# EAGLE schematic Regulators (EAGLE 8.6.0)
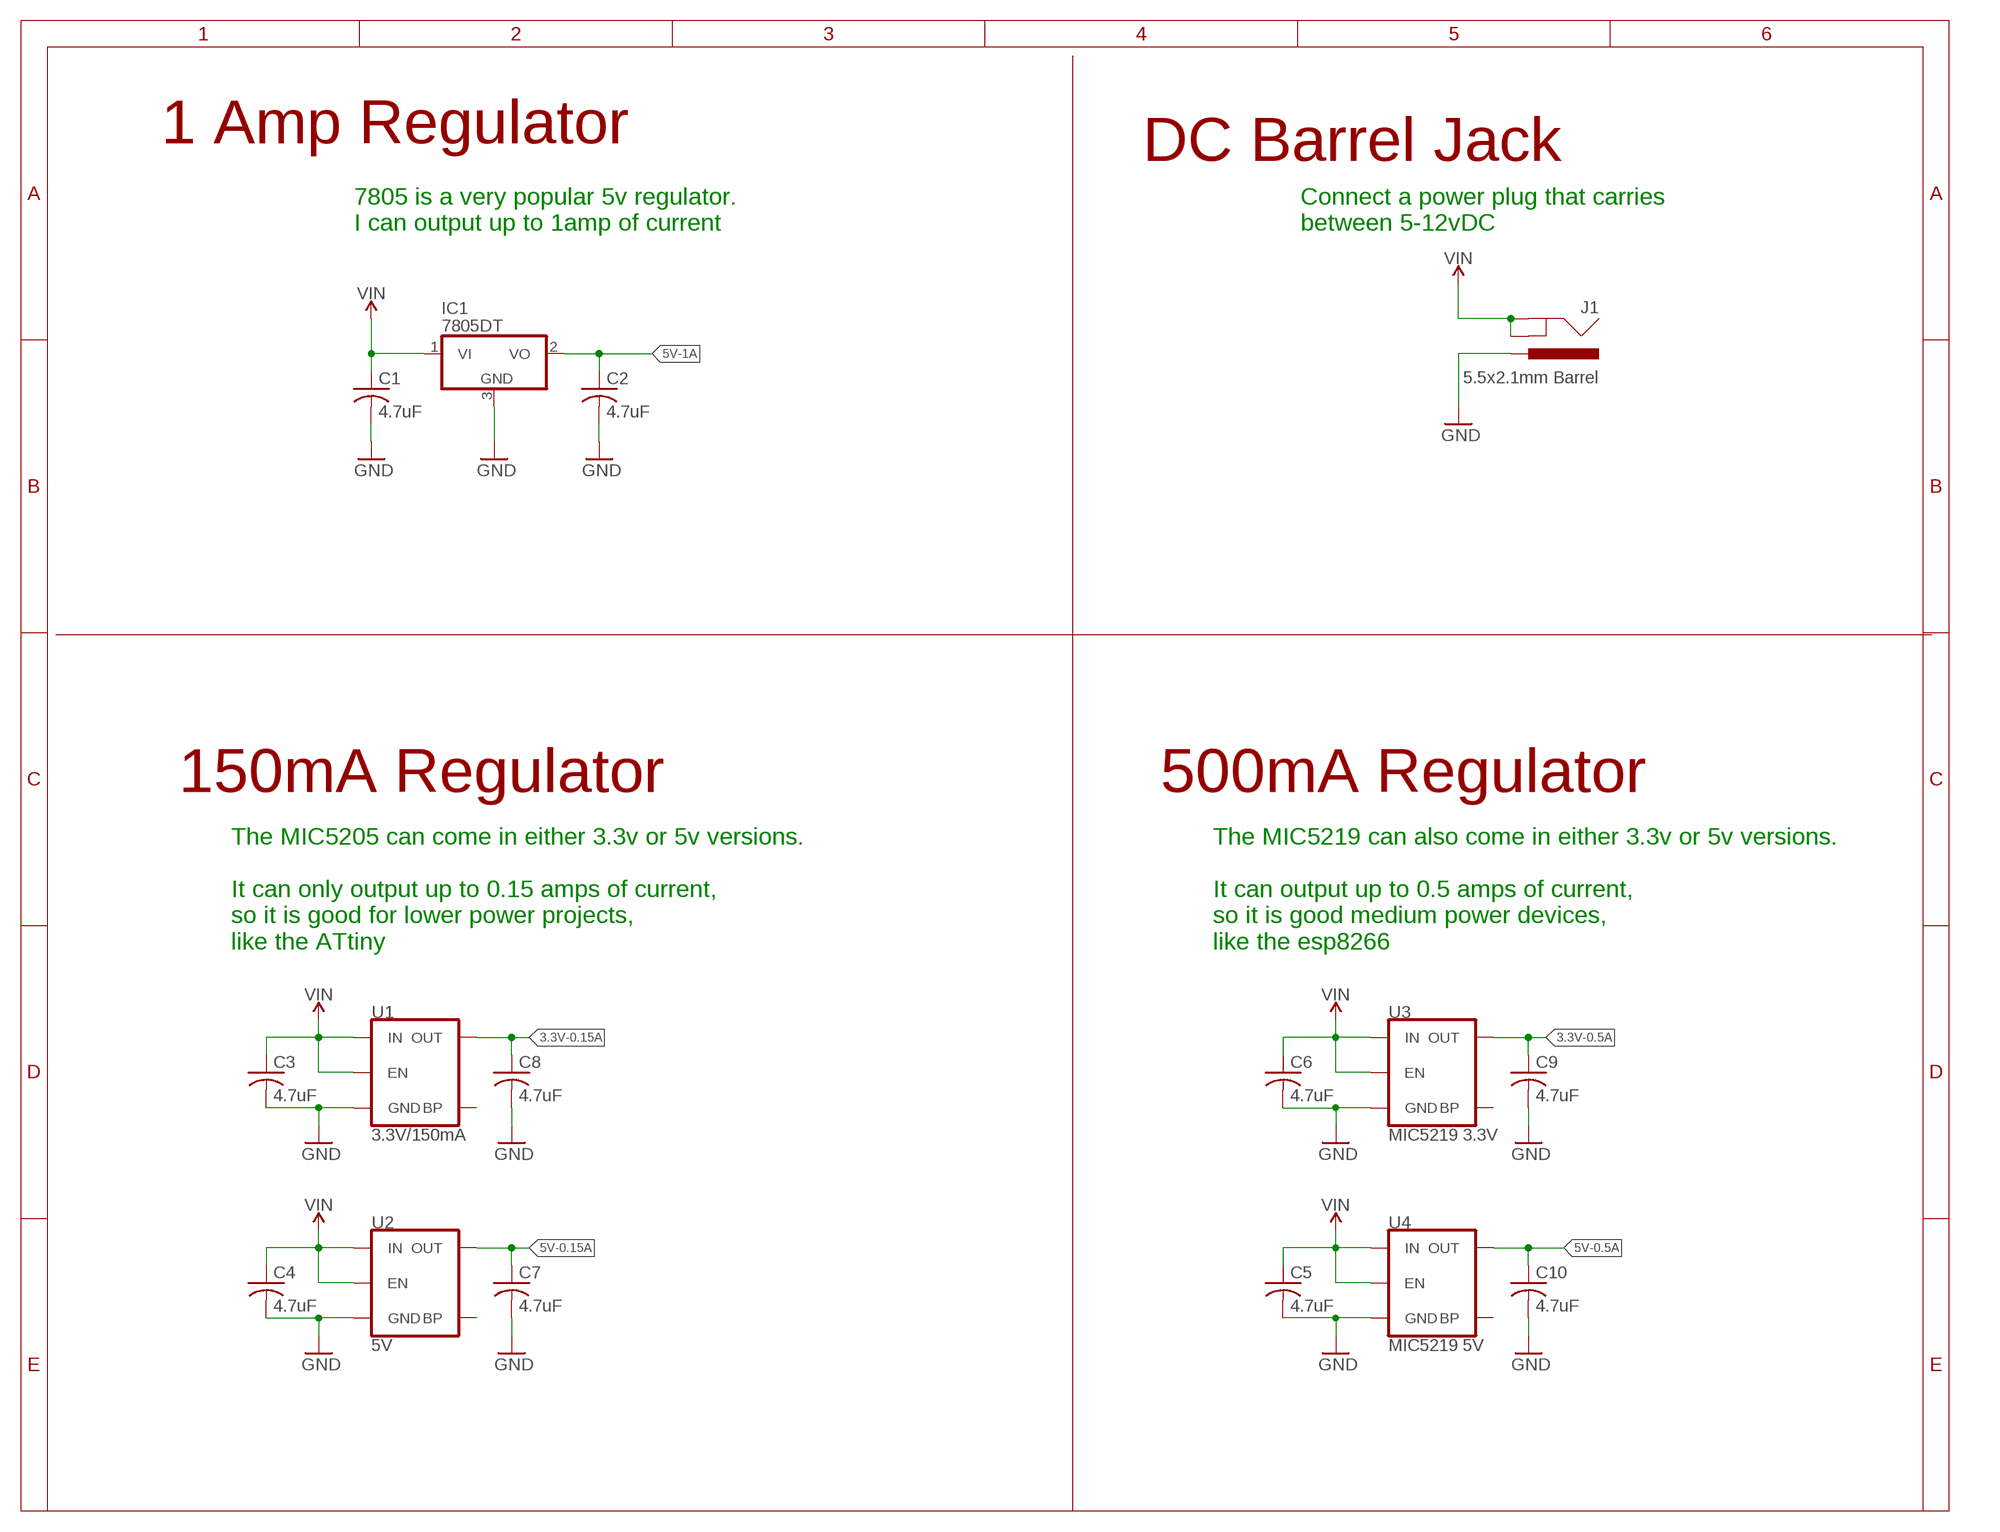
[diagram p0: schematic, sheet 1]

## Parts
C1  4.7uF  C-USC0603  [C0603]
C2  4.7uF  C-USC0603  [C0603]
C3  4.7uF  C-USC0603  [C0603]
C4  4.7uF  C-USC0603  [C0603]
C5  4.7uF  C-USC0603  [C0603]
C6  4.7uF  C-USC0603  [C0603]
C7  4.7uF  C-USC0603  [C0603]
C8  4.7uF  C-USC0603  [C0603]
C9  4.7uF  C-USC0603  [C0603]
C10  4.7uF  C-USC0603  [C0603]
IC1  7805DT  [TO252]
J1  5.5x2.1mm Barrel  POWER_JACKSMD  [POWER_JACK_SMD]
U1  3.3V/150mA  V_REG_MIC52053.3V  [SOT23-5]
U2  5V  V_REG_MIC52055V  [SOT23-5]
U3  MIC5219 3.3V  V_REG_MIC52193.3V  [SOT23-5]
U4  MIC5219 5V  V_REG_MIC52195V  [SOT23-5]

## Nets
3.3V-0.5A: C9.1 U3.5(OUT)
3.3V-0.15A: C8.1 U1.5(OUT)
5V-0.5A: C10.1 U4.5(OUT)
5V-0.15A: C7.1 U2.5(OUT)
5V-1A: C2.1 IC1.2(VO)
GND: C1.2 C2.2 C3.2 C4.2 C5.2 C6.2 C7.2 C8.2 C9.2 C10.2 IC1.3(GND) J1.VIN0(PWR) U1.2(GND) U2.2(GND) U3.2(GND) U4.2(GND)
VIN: C1.1 C3.1 C4.1 C5.1 C6.1 IC1.1(VI) J1.GND(GNDBREAK) J1.P$4(GND) U1.1(IN) U1.3(EN) U2.1(IN) U2.3(EN) U3.1(IN) U3.3(EN) U4.1(IN) U4.3(EN)
Unconnected: U1.4(BP) U2.4(BP) U3.4(BP) U4.4(BP)

## Notes on the sheet
- 1 Amp Regulator | DC Barrel Jack
- 7805 is a very popular 5v regulator.
  I can output up to 1amp of current
- Connect a power plug that carries
  between 5-12vDC
- 150mA Regulator | 500mA Regulator
- The MIC5205 can come in either 3.3v or 5v versions.
  
  It can only output up to 0.15 amps of current,
  so it is good for lower power projects,
  like the ATtiny
- The MIC5219 can also come in either 3.3v or 5v versions.
  
  It can output up to 0.5 amps of current,
  so it is good medium power devices,
  like the esp8266

## Library data of the parts
C1-C10 = adafruit:C-US: CAPACITOR, American symbol
IC1 = adafruit:78*: Positive VOLTAGE REGULATOR Added bigger pads to the TO-92 package
J1 = SparkFun-Connectors:POWER_JACK: Power Jack Connector This is the standard 5.5mm barrel jack for power. The PTH is the most common, proven, reliable, footprint. The Slot footprint only works if the mill layer is transmitted to the PCB fab house so be warned. Here are the connectors we sell at SparkFun: DC Barrel Power Jack/Connector <https://www.sparkfun.com/products/119> (PRT-00119) DC Barrel Power Jack/Connector (SMD) <https://www.sparkfun.com/products/12748> (PRT-12748) DC Barrel Jack Adapter - Breadboard Compatible <https://www.sparkfun.com/products/10811> (PRT-10811) It is used on this SparkFun product (and many, many others): SparkFun RedBoard - Programmed with Arduino <https://www.sparkfun.com/products/12757> (DEV-12757) Also, if you need a mating power supply or connector, please check these out: Wall Adapter Power Supply - 9VDC 650mA <https://www.sparkfun.com/products/298> (TOL-00298) DC Barrel Jack Adapter - Male <https://www.sparkfun.com/products/10287> (PRT-10287); PROD_ID: CONN-08106; SF_ID: PRT-12748
U1 = SparkFun-IC-Power:V_REG_MIC5205: V_REG MIC5205 Standard 3.3V, 5V, and Adjustable 150mA LDO voltage regulator in SOT-23 layout. Micrel part MIC5205. BP (by-pass) pin is used to lower output noise with 470pF cap, may be left open. On the adjustable version BP is used to set output.; PROD_ID: VREG-00822
U2 = SparkFun-IC-Power:V_REG_MIC5205: V_REG MIC5205 Standard 3.3V, 5V, and Adjustable 150mA LDO voltage regulator in SOT-23 layout. Micrel part MIC5205. BP (by-pass) pin is used to lower output noise with 470pF cap, may be left open. On the adjustable version BP is used to set output.; PROD_ID: VREG-00823
U3 = SparkFun-IC-Power:V_REG_MIC5219: V_REG MIC5219 Standard 3.3V and 5V 500mA LDO voltage regulator in SOT-23 layout. Micrel part MIC5219. BP (by-pass) pin is used to lower output noise with 470pF cap, may be left open.; PROD_ID: VREG-09872
U4 = SparkFun-IC-Power:V_REG_MIC5219: V_REG MIC5219 Standard 3.3V and 5V 500mA LDO voltage regulator in SOT-23 layout. Micrel part MIC5219. BP (by-pass) pin is used to lower output noise with 470pF cap, may be left open.; PROD_ID: VREG-10107